# Altium schematic sheet pmod_ssd.SchDoc
size A; SheetNumber: 1; SheetTotal: 1
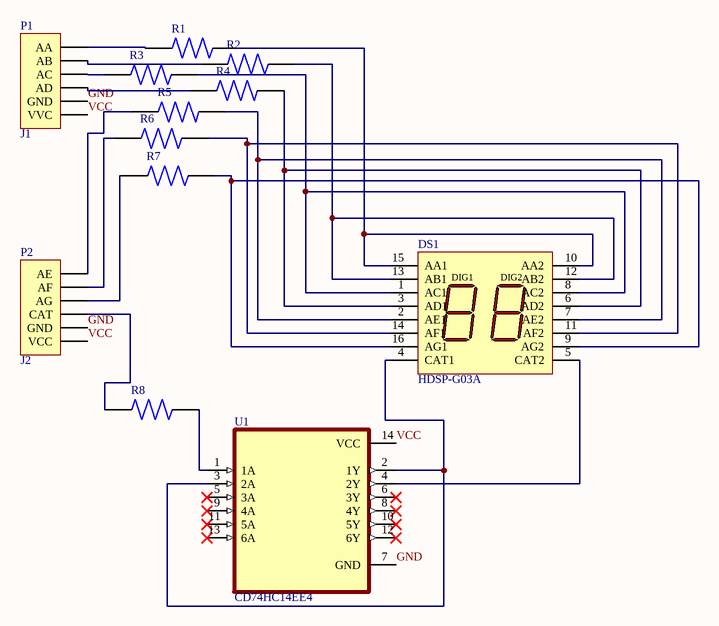
[diagram p0: pmod_ssd.SchDoc]

## Parts
DS1  HDSP-G03A  [G-16]
P1  J1  [HDR1X6H]
P2  J2  [HDR1X6H]
R1  5-2176327-9  [RESC2012X65N]  (value not drawn)
R2  5-2176327-9  [RESC2012X65N]  (value not drawn)
R3  5-2176327-9  [RESC2012X65N]  (value not drawn)
R4  5-2176327-9  [RESC2012X65N]  (value not drawn)
R5  5-2176327-9  [RESC2012X65N]  (value not drawn)
R6  5-2176327-9  [RESC2012X65N]  (value not drawn)
R7  5-2176327-9  [RESC2012X65N]  (value not drawn)
R8  5-2176327-9  [RESC2012X65N]  (value not drawn)
U1  CD74HC14EE4  [DIP794W45P254L1969H508Q14]

## Nets
GND: P1.5(GND) P2.5(GND) U1.7(GND)
VCC: P1.6(VVC) P2.6(VCC) U1.14(VCC)
NetDS1_1: DS1.1(AC1) DS1.8(AC2) R3.2
NetDS1_2: DS1.2(AE1) DS1.7(AE2) R5.2
NetDS1_3: DS1.3(AD1) DS1.6(AD2) R4.2
NetDS1_4: DS1.4(CAT1) U1.2(1Y) U1.3(2A)
NetDS1_5: DS1.5(CAT2) U1.4(2Y)
NetDS1_9: DS1.9(AG2) DS1.16(AG1) R7.2
NetDS1_10: DS1.10(AA2) DS1.15(AA1) R1.2
NetDS1_11: DS1.11(AF2) DS1.14(AF1) R6.2
NetDS1_12: DS1.12(AB2) DS1.13(AB1) R2.2
NetP1_1: P1.1(AA) R1.1
NetP1_2: P1.2(AB) R2.1
NetP1_3: P1.3(AC) R3.1
NetP1_4: P1.4(AD) R4.1
NetP2_1: P2.1(AE) R5.1
NetP2_2: P2.2(AF) R6.1
NetP2_3: P2.3(AG) R7.1
NetP2_4: P2.4(CAT) R8.1
NetR8_2: R8.2 U1.1(1A)

Not connected (* = marked no-connect by the designer): U1 5(3A)* 6(3Y)* 8(4Y)* 9(4A)* 10(5Y)* 11(5A)* 12(6Y)* 13(6A)*

## Notes on the sheet
- github/bünyaminarslan
- linkedin/in/bünyamin/
- 190207034
- (in symbol HDSP-G03A) DIG1; DIG2

## Library data of the parts
DS1 = HDSP-G03A: 10.16 mm 2-Digit General Purpose AlGaAs Red 7-Segment Display: CC, RH DP; LuminousIntensity: 3200 ucd (Minimum).; Published: 26-May-2004; LatestRevisionDate: 11-Oct-2004; LatestRevisionNote: Display outline superimposed on PCB Footprint.; DatasheetDocument: 20-Aug-2001; PackageDocument: 20-Aug-2001; PackageReference: G-16; Publisher: Altium Limited; LED_Colour: AlGaAs Red; ComponentLink1Description: Manufacturer Link; ComponentLink1URL: http://www.agilent.com/; ComponentLink2Description: Datasheet; ComponentLink2URL: http://cp.literature.agilent.com/litweb/pdf/5988-2972EN.pdf
P1 P2 = Header 6H: Header, 6-Pin, Right Angle; LatestRevisionDate: 17-Jul-2002; LatestRevisionNote: Re-released for DXP Platform.; Publisher: Altium Limited
R1-R8 = 5-2176327-9: Fixed Resistor CRGP 0805 680K 1%; Package: None; Price: None; Value: *; MP: 5-2176327-9; Availability: Unavailable
U1 = CD74HC14EE4: High Speed CMOS Logic Hex Schmitt-Triggered Inverters 14-PDIP -55 to 125; MF: Texas Instruments; Package: PDIP-14 Texas Instruments; Price: None; Check_prices: https://www.snapeda.com/parts/CD74HC14EE4/Texas+Instruments/view-part/?ref=eda; Value: *; SnapEDA_Link: https://www.snapeda.com/parts/CD74HC14EE4/Texas+Instruments/view-part/?ref=snap; MP: CD74HC14EE4; Availability: In Stock; Purchase-URL: https://pricing.snapeda.com/search/part/CD74HC14EE4/?ref=eda